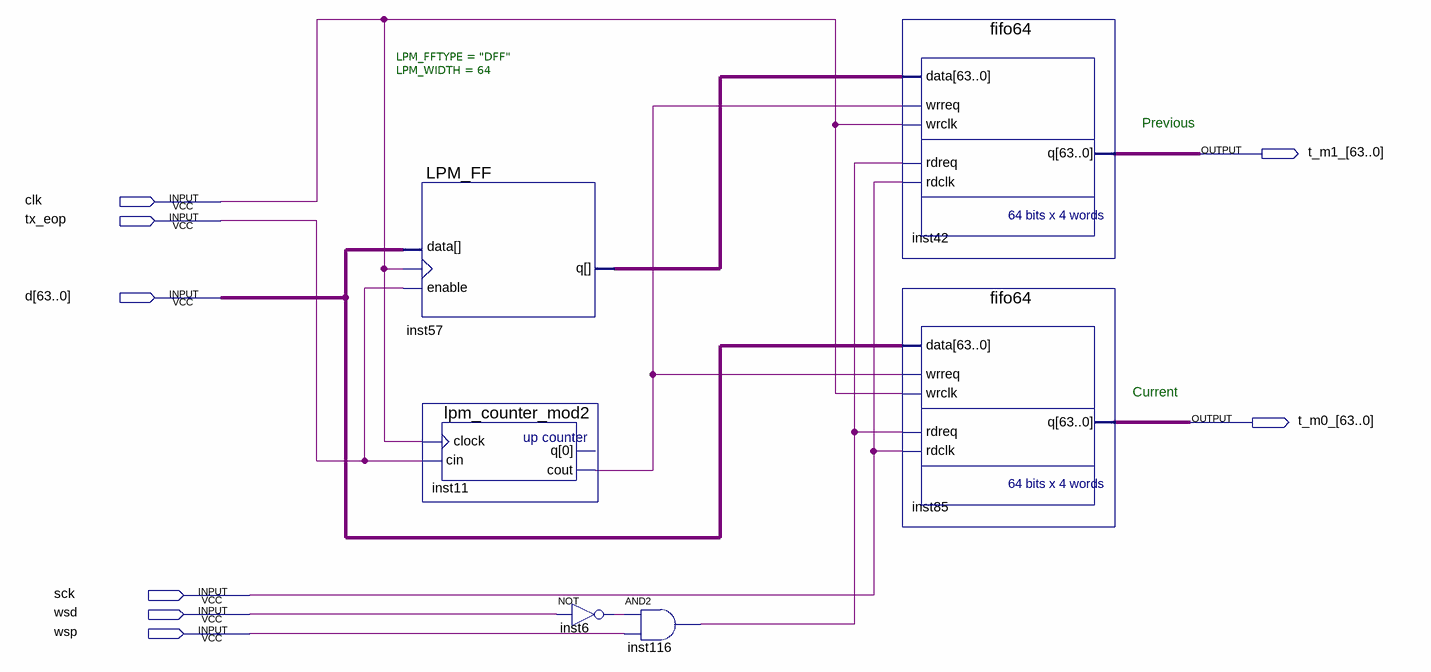
[diagram p0: schematic sheet]
// Quartus schematic spec96_to_i2s.bdf as structural Verilog: 6 symbols, 8 pins
module spec96_to_i2s (
  input  clk,
  input  tx_eop,
  input  [63:0] d,
  input  sck,
  input  wsd,
  input  wsp,
  output [63:0] t_m1_,
  output [63:0] t_m0_
);

  wire inst6_out, inst11_cout, inst116_out;
  wire [63:0] inst57_q;

  LPM_FF #(.LPM_FFTYPE("DFF"), .LPM_WIDTH(64)) inst57 (.enable(tx_eop), .clock(clk), .data(d), .q(inst57_q));
  lpm_counter_mod2 inst11 (.clock(clk), .cin(tx_eop), .cout(inst11_cout));  // open: q
  not inst6 (inst6_out, wsd);
  and inst116 (inst116_out, inst6_out, wsp);
  fifo64 inst42 (.data(inst57_q), .wrreq(inst11_cout), .wrclk(clk), .rdreq(inst116_out), .rdclk(sck), .q(t_m1_));
  fifo64 inst85 (.data(d), .wrreq(inst11_cout), .wrclk(clk), .rdreq(inst116_out), .rdclk(sck), .q(t_m0_));

  // Notes on the sheet:
  //   Previous
  //   Current
endmodule
